# EasyEDA Pro project SmartDorm-ESP32.eprj

# Schematic Schematic1
Create Date: 2022-11-20; Page Name: P1; Project Name: SmartDorm-ESP32; Schematic Name: Schematic1; Update Date: 2022-11-20; Company: 嘉立创EDA; Page Size: A4; Version: V1.0
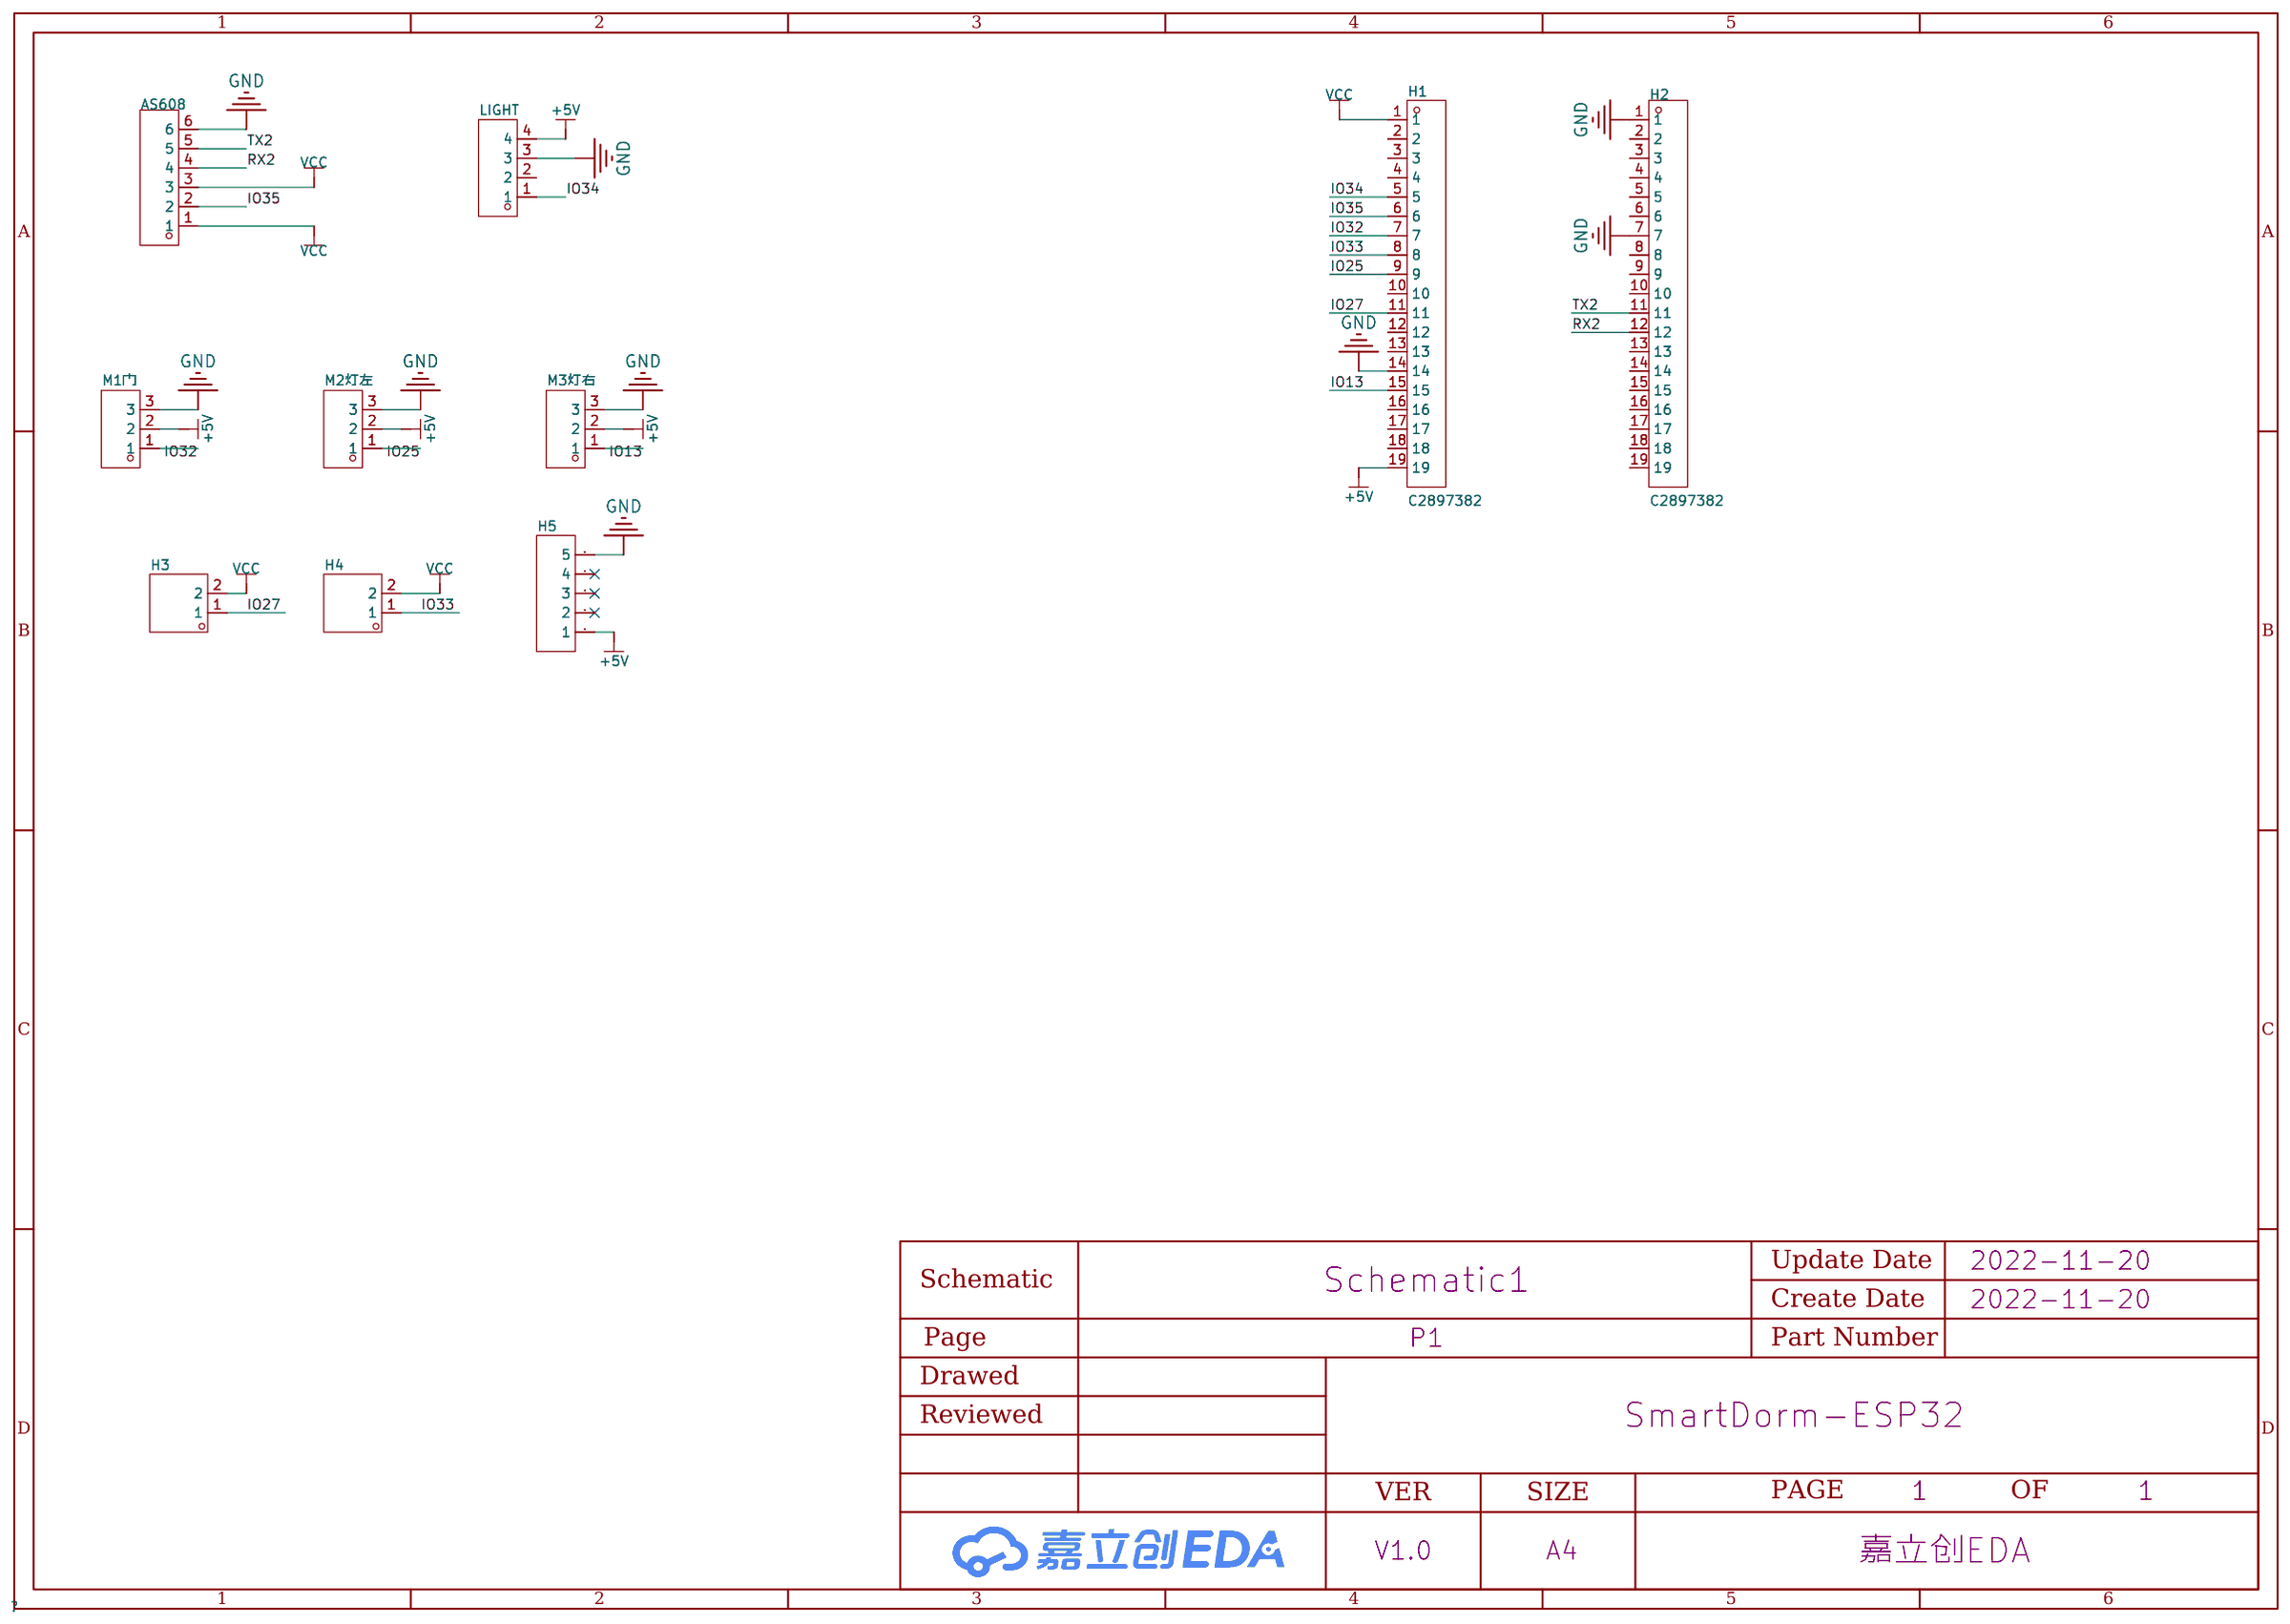
[diagram p0: schematic sheet]

## Parts
AS608  -  [HDR-TH_6P-P2.54-V-F]
H1  C2897382  [HDR-TH_19P-P2.54-V-F]
H2  C2897382  [HDR-TH_19P-P2.54-V-F]
H3  -  [HDR-TH_2P-P2.54-V-M-1]
H4  -  [HDR-TH_2P-P2.54-V-M-1]
H5  -  [HDR-TH_5P-P2.54-V-F]
LIGHT  -  [HDR-TH_4P-P2.54-V-F]
M1门  -  [HDR-TH_3P-P2.54-V-M]
M2灯左  -  [HDR-TH_3P-P2.54-V-M]
M3灯右  -  [HDR-TH_3P-P2.54-V-M]

## Library data of the parts
AS608 = HDR-F_2.54_1x6P: Supplier Part: C40877; Supplier Footprint: 插件
H1 H2 = HDR-F_2.54_1x19P: Supplier Footprint: 插件
H3 H4 = HDR-M_2.54_1x2P: Supplier Part: C124375; Supplier Footprint: 插件
H5 = HDR-F_2.54_1x5P: Supplier Part: C50950; Supplier Footprint: 插件
LIGHT = HDR-F_2.54_1x4P: Supplier Part: C2718488; Supplier Footprint: 插件
M1门 M2灯左 M3灯右 = HDR-M_2.54_1x3P: Supplier Part: C2937625; Supplier Footprint: 插件

## Nets
+5V: H1.19 H5.1 LIGHT.4 M1门.2 M2灯左.2 M3灯右.2
GND: AS608.6 H1.14 H2.1 H2.7 H5.5 LIGHT.3 M1门.3 M2灯左.3 M3灯右.3
VCC: AS608.1 AS608.3 H1.1 H3.2 H4.2
IO13: H1.15 M3灯右.1
IO25: H1.9 M2灯左.1
IO27: H1.11 H3.1
IO32: H1.7 M1门.1
IO33: H1.8 H4.1
IO34: H1.5 LIGHT.1
IO35: AS608.2 H1.6
RX2: AS608.4 H2.12
TX2: AS608.5 H2.11

Not connected (* = marked no-connect by the designer): H1 2 3 4 10 12 13 16 17 18; H2 2 3 4 5 6 8 9 10 13 14 15 16 17 18 19; H5 2* 3* 4*; LIGHT 2

# Board PCB1
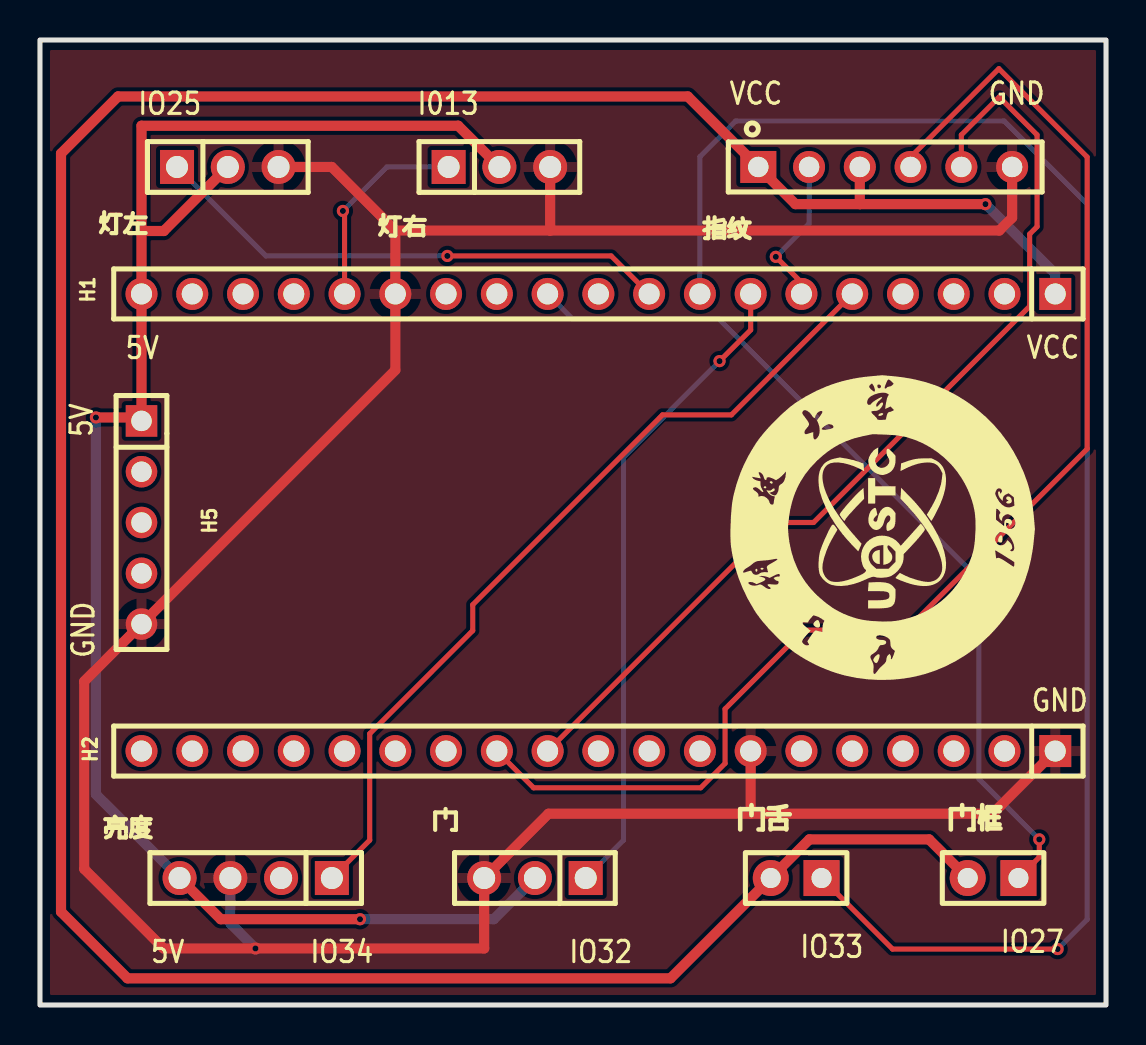
[diagram p1: board, top side]
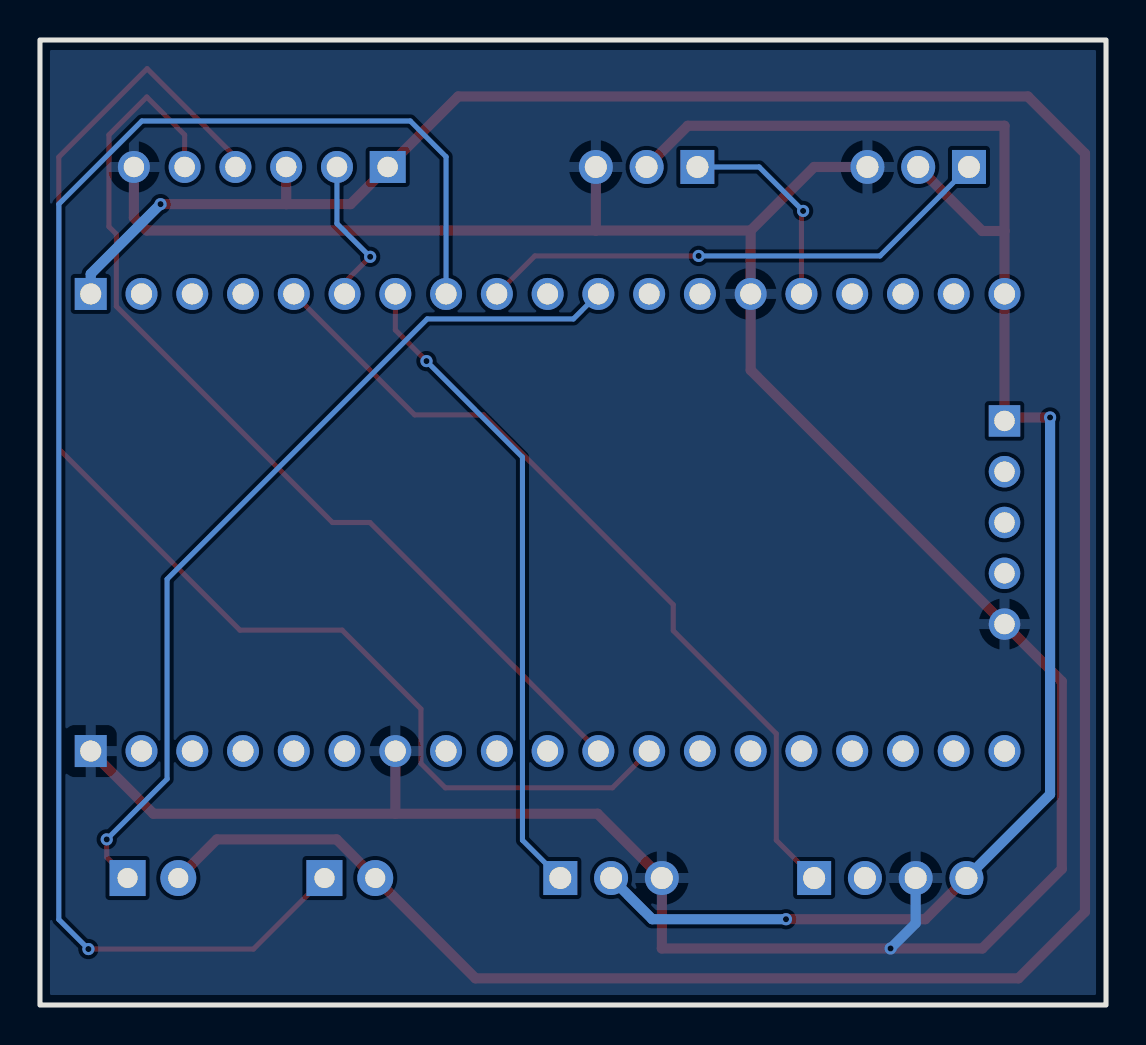
[diagram p2: board, bottom side, seen from below]

Outline 53.34 x 48.26 mm; copper layers: Top Layer, Bottom Layer. Coordinates in mm from the lower left corner of the outline.
Outline path: rectangle 0,0 53.34,48.26
Stack: Top Layer 0.035mm / Dielectric1 1.51mm FR4 er 4.5 / Bottom Layer 0.035mm

## Design rules (mm)
spacing safeClearance (default): track to track 0.152, other pairs 0.152 to 0.3
track width trackWidth (default): min 0.127, default 0.254, max 2.54
track width trackWidth2: min 0.381, default 0.508, max 2.54
differential pair differentialPair (default): width min 0.127, default 0.254, max 2.54; gap min 0.152, default 0.152
via viaSize (default): diameter min 0.5, default 0.61, max 10; hole min 0.3, default 0.305, max 6
net GND uses trackWidth2
net VCC uses trackWidth2
net +5V uses trackWidth2

## Placement (name value [footprint] x y rotation side)
H1  C2897382  [HDR-TH_19P-P2.54-V-F]  27.94 35.56 180 top
H2  C2897382  [HDR-TH_19P-P2.54-V-F]  27.94 12.7 180 top
H3  -  [HDR-TH_2P-P2.54-V-M-1]  47.69 6.35 180 top
H4  -  [HDR-TH_2P-P2.54-V-M-1]  37.83 6.35 180 top
H5  -  [HDR-TH_5P-P2.54-V-F]  5.08 24.13 270 top
亮度  -  [HDR-TH_4P-P2.54-V-F]  10.8 6.35 180 top
指纹  -  [HDR-TH_6P-P2.54-V-F]  42.29 41.91 0 top
灯右  -  [HDR-TH_3P-P2.54-V-M]  22.99 41.91 0 top
灯左  -  [HDR-TH_3P-P2.54-V-M]  9.4 41.91 0 top
门  -  [HDR-TH_3P-P2.54-V-M]  24.77 6.35 180 top

## Footprints (pads in the part's own frame, mm; a bottom-side part is the same pattern mirrored in y, then rotated)
HDR-TH_2P-P2.54-V-M-1
  rect 1.8x1.8 hole 1: 1(-1.27,0)
  round 1.8 hole 1: 2(1.27,0)
HDR-TH_3P-P2.54-V-M
  rect 1.7x1.7 hole 1.1: 1(-2.54,0)
  round 1.7 hole 1.1: 2(0,0) 3(2.54,0)
HDR-TH_4P-P2.54-V-F
  rect 1.7x1.7 hole 1.1: 1(-3.81,0)
  round 1.7 hole 1.1: 2(-1.27,0) 3(1.27,0) 4(3.81,0)
HDR-TH_5P-P2.54-V-F
  rect 1.575x1.575 hole 1.02: 1(-5.08,0)
  round 1.575 hole 1.02: 2(-2.54,0) 3(0,0) 4(2.54,0) 5(5.08,0)
HDR-TH_6P-P2.54-V-F
  rect 1.8x1.6 hole 1.02: 1(-6.35,0)
  round 1.6 hole 1.02: 2(-3.81,0) 3(-1.27,0) 4(1.27,0) 5(3.81,0) 6(6.35,0)
HDR-TH_19P-P2.54-V-F
  rect 1.6x1.6 hole 1.05: 1(-22.86,0)
  round 1.6 hole 1.05: 2(-20.32,0) 3(-17.78,0) 4(-15.24,0) 5(-12.7,0) 6(-10.16,0) 7(-7.62,0) 8(-5.08,0) 9(-2.54,0) 10(0,0) 11(2.54,0) 12(5.08,0) 13(7.62,0) 14(10.16,0) 15(12.7,0) 16(15.24,0) 17(17.78,0) 18(20.32,0) 19(22.86,0)

## Nets
+5V: H1.19 H5.1 亮度.4 灯右.2 灯左.2 门.2
GND: H1.14 H2.1 H2.7 H5.5 亮度.3 指纹.6 灯右.3 灯左.3 门.3
VCC: H1.1 H3.2 H4.2 指纹.1 指纹.3
IO13: H1.15 灯右.1
IO25: H1.9 灯左.1
IO27: H1.11 H3.1
IO32: H1.7 门.1
IO33: H1.8 H4.1
IO34: H1.5 亮度.1
IO35: H1.6 指纹.2
RX2: H2.12 指纹.4
TX2: H2.11 指纹.5

Pads without a net: H1 2 3 4 10 12 13 16 17 18; H2 2 3 4 5 6 8 9 10 13 14 15 16 17 18 19; H5 2 3 4; 亮度 2

## Via types
v1: diameter 0.61, hole 0.305, Top Layer to Bottom Layer, 10 vias

## Routing (per net, layer and track width the routed paths; a pad name or vN(x,y) marks a point on that pad's centre or on a via; arc(x,y) is an arc through that point)
+5V: length 85.7
  Top Layer w0.508: 5.08,38.71 5.08,43.97 20.93,43.97 灯右.2 ; 5.08,38.71 H1.19 5.08,29.38 ; 5.08,38.71 6.2,38.71 灯左.2 ; v1(16.01,4.29) 9.04,4.29 亮度.4 ; 5.08,29.38 v1(2.8,29.38) ; 5.08,29.38 H5.1
  Bottom Layer w0.508: v1(2.8,29.38) 2.8,10.53 亮度.4 ; v1(16.01,4.29) 22.71,4.29 门.2
GND: length 145.9
  Top Layer w0.508: 25.53,38.73 灯右.3 ; 25.53,38.73 17.78,38.73 ; 25.53,38.73 48,38.73 48.64,39.37 指纹.6 ; 17.78,38.73 14.6,41.91 灯左.3 ; 17.78,38.73 H1.14 17.78,31.75 H5.5 2.21,16.18 2.21,6.8 6.19,2.83 v1(10.78,2.83) 22.23,2.83 门.3 25.44,9.57 35.56,9.57 ; 35.56,9.57 H2.7 ; 35.56,9.57 47.67,9.57 H2.1
  Bottom Layer w0.508: v1(10.78,2.83) 9.52,4.08 亮度.3
VCC: length 145.8
  Top Layer w0.508: 41.02,40.05 指纹.3 ; 41.02,40.05 v1(47.31,40.05) ; 41.02,40.05 37.8,40.05 指纹.1 32.41,45.44 3.91,45.44 1.05,42.58 1.05,4.66 4.38,1.33 31.55,1.33 38.5,8.28 44.49,8.28 H3.2
  Bottom Layer w0.508: v1(47.31,40.05) 50.8,36.56 H1.1
IO13: length 10.4
  Top Layer w0.254: v1(15.16,39.71) 15.24,39.63 H1.15
  Bottom Layer w0.254: 20.45,41.91 17.36,41.91 v1(15.16,39.71)
IO25: length 26.3
  Top Layer w0.254: v1(20.38,37.46) 28.58,37.46 H1.9
  Bottom Layer w0.254: v1(20.38,37.46) 11.31,37.46 灯左.1
IO27: length 44.1
  Top Layer w0.254: v1(50,8.28) 50,7.39 48.96,6.35
  Bottom Layer w0.254: v1(50,8.28) 46.98,11.3 46.98,21.3 33.96,34.31 26.65,34.31 H1.11
IO32: length 32.6
  Top Layer w0.254: H1.7 35.56,33.76 v1(34,32.2)
  Bottom Layer w0.254: v1(34,32.2) 29.2,27.4 29.2,8.24 门.1
IO33: length 79.8
  Top Layer w0.254: v1(50.92,2.8) 42.66,2.8 H4.1
  Bottom Layer w0.254: v1(50.92,2.8) 52.4,4.28 52.4,40.05 48.24,44.21 34.81,44.21 33.02,42.42 H1.8
IO34: length 42
  Top Layer w0.254: 亮度.1 16.5,8.24 16.5,13.57 21.65,18.72 21.65,20.02 31.15,29.51 34.59,29.51 H1.5
IO35: length 7.6
  Top Layer w0.254: H1.6 38.1,36.13 v1(36.82,37.42)
  Bottom Layer w0.254: 指纹.2 38.48,39.08 v1(36.82,37.42)
RX2: length 66.5
  Top Layer w0.254: H2.12 24.7,10.86 33.06,10.86 34.28,12.08 34.28,14.81 38.22,18.75 43.34,18.75 52.4,27.81 52.4,42.41 47.98,46.82 43.56,42.41 指纹.4
TX2: length 49
  Top Layer w0.254: H2.11 36.83,24.13 38.71,24.13 49.52,34.94 49.52,38.55 49.89,38.92 49.89,43.51 48,45.41 46.1,43.51 指纹.5

## Copper pours and planes (outline as drawn; the poured copper is in the pictures)
GND on Top Layer: 0,48.26 53.34,48.26 53.34,0 0,0
GND on Bottom Layer: 0,48.26 53.34,48.26 53.34,0 0,0

## Text on the board
Top Silkscreen Layer: 5V | IO25 | IO34 | I013 | IO32 | VCC | IO33 | GND | IO27 | 门舌 | 门框
